# Altium schematic sheet EMG_v5.SchDoc
size 297 x 209 mm
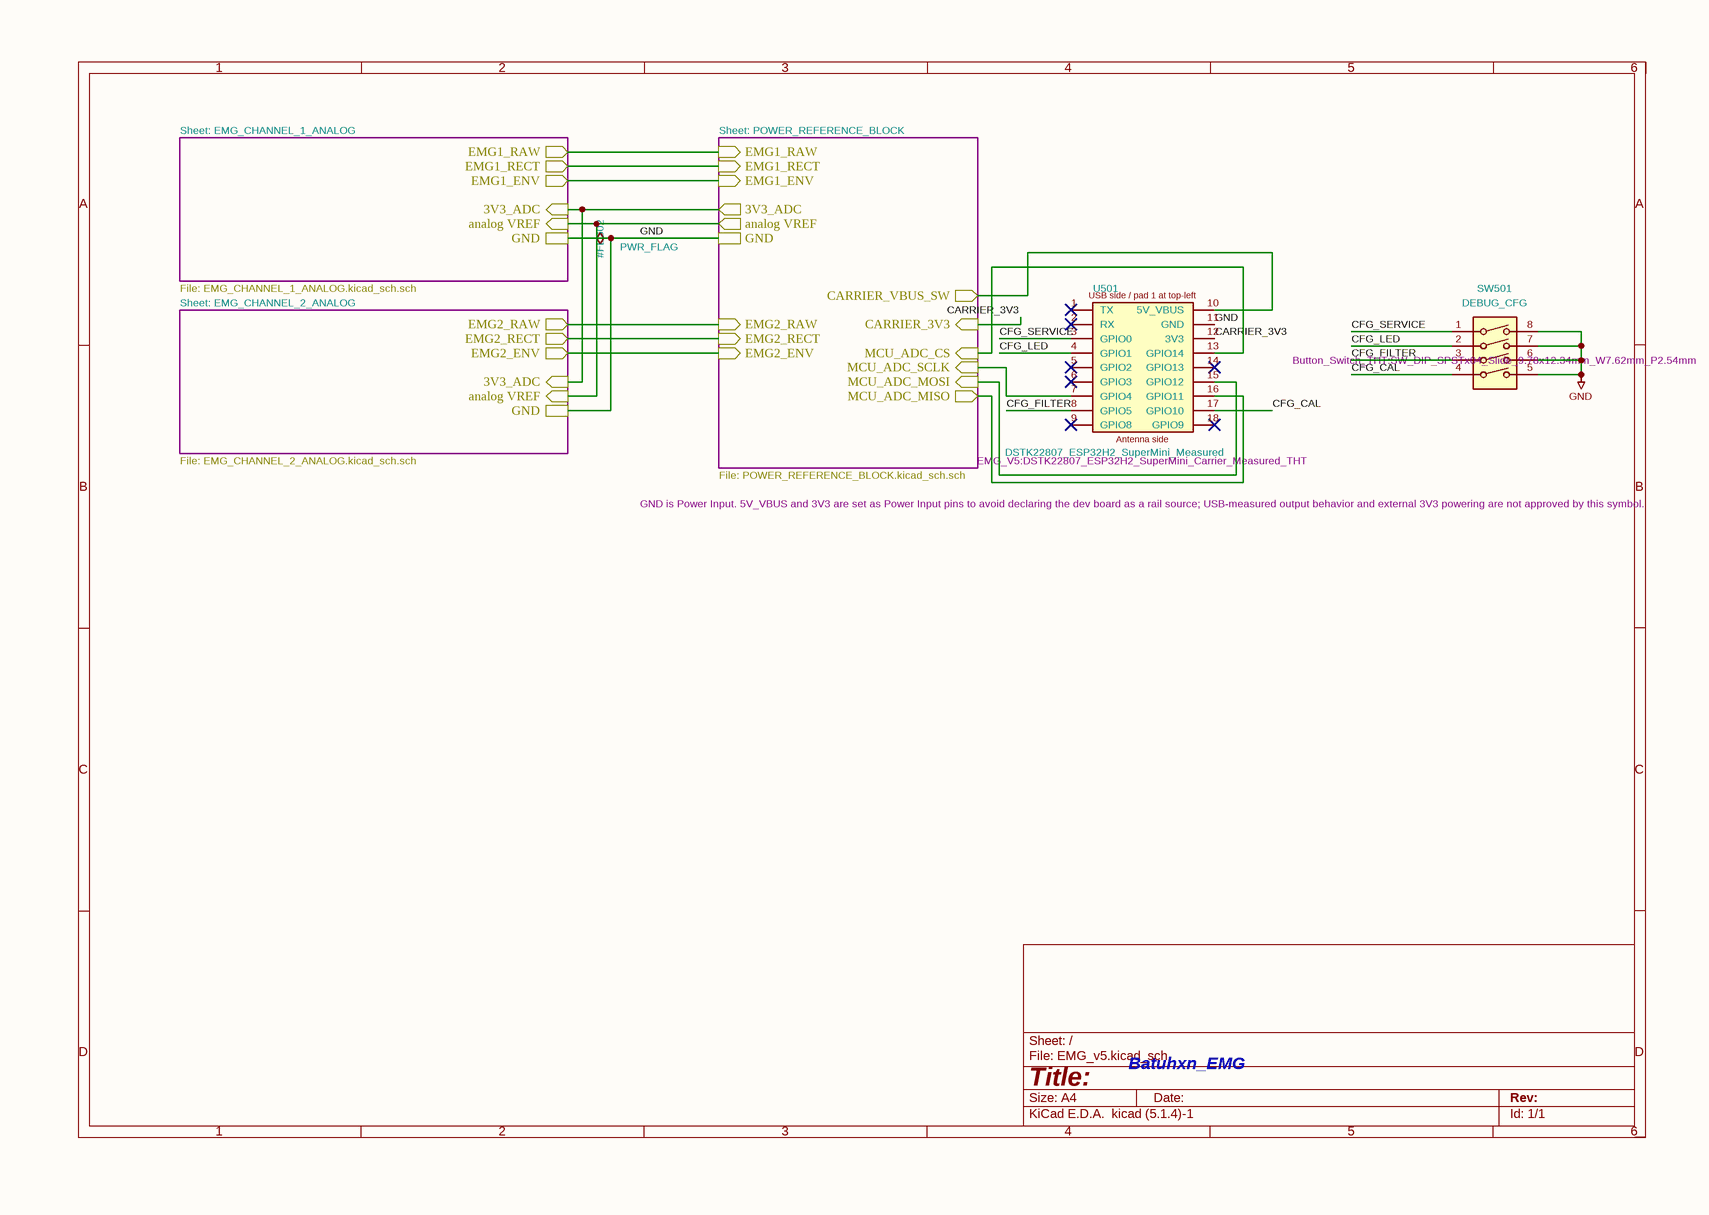
[diagram p0: EMG_v5.SchDoc]

## Parts
#FLG02  PWR_FLAG  (graphical)
SW501  Footprint: Button_Switch_THT:SW_DIP_SPSTx04_Slide_9.78x12.34mm_W7.62mm_P2.54mm  [SW_DIP_SPSTx04_Slide_9.78x12.34mm_W7.62mm_P2.54mm]  (hidden comment: DEBUG_CFG)
U501  Power_Assumption: GND is Power Input. 5V_VBUS and 3V3 are set as Power Input pins to avoid declaring the dev board as a rail source; USB-measured output behavior and external 3V3 powering are not approved by this symbol.  Footprint: EMG_V5:DSTK22807_ESP32H2_SuperMini_Carrier_Measured_THT  [DSTK22807_ESP32H2_SuperMini_Carrier_Measured_THT]  (hidden comment: DSTK22807_ESP32H2_SuperMini_Measured)

## Sub-sheets
EMG_CHANNEL_1_ANALOG = EMG_CHANNEL_1_ANALOG.SchDoc: EMG1_RAW (out), EMG1_RECT (out), EMG1_ENV (out), 3V3_ADC (in), analog VREF (in), GND
EMG_CHANNEL_2_ANALOG = EMG_CHANNEL_2_ANALOG.SchDoc: EMG2_RAW (out), EMG2_RECT (out), EMG2_ENV (out), 3V3_ADC (in), analog VREF (in), GND
POWER_REFERENCE_BLOCK = POWER_REFERENCE_BLOCK.SchDoc: EMG1_RAW (in), EMG1_RECT (in), EMG1_ENV (in), EMG2_RAW (in), EMG2_RECT (in), EMG2_ENV (in), 3V3_ADC (out), analog VREF (out), GND, CARRIER_VBUS_SW (out), CARRIER_3V3 (in), MCU_ADC_MISO (out), MCU_ADC_MOSI (in), MCU_ADC_SCLK (in), MCU_ADC_CS (in)

## Nets
GND: #FLG02.1 SW501.5 SW501.6 SW501.7 SW501.8 U501.11(GND) ; sheet POWER_REFERENCE_BLOCK/GND, sheet EMG_CHANNEL_1_ANALOG/GND, sheet EMG_CHANNEL_2_ANALOG/GND
CARRIER_3V3: U501.12(3V3) ; sheet POWER_REFERENCE_BLOCK/CARRIER_3V3
CFG_CAL: SW501.4 U501.17(GPIO10)
CFG_FILTER: SW501.3 U501.8(GPIO5)
CFG_LED: SW501.2 U501.4(GPIO1)
CFG_SERVICE: SW501.1 U501.3(GPIO0)
NetU501_7: U501.7(GPIO4) ; sheet POWER_REFERENCE_BLOCK/MCU_ADC_SCLK
NetU501_10: U501.10(5V_VBUS) ; sheet POWER_REFERENCE_BLOCK/CARRIER_VBUS_SW
NetU501_13: U501.13(GPIO14) ; sheet POWER_REFERENCE_BLOCK/MCU_ADC_CS
NetU501_15: U501.15(GPIO12) ; sheet POWER_REFERENCE_BLOCK/MCU_ADC_MOSI
NetU501_16: U501.16(GPIO11) ; sheet POWER_REFERENCE_BLOCK/MCU_ADC_MISO
(unnamed): sheet POWER_REFERENCE_BLOCK/EMG1_RAW, sheet EMG_CHANNEL_1_ANALOG/EMG1_RAW
(unnamed): sheet POWER_REFERENCE_BLOCK/EMG1_RECT, sheet EMG_CHANNEL_1_ANALOG/EMG1_RECT
(unnamed): sheet POWER_REFERENCE_BLOCK/EMG1_ENV, sheet EMG_CHANNEL_1_ANALOG/EMG1_ENV
(unnamed): sheet POWER_REFERENCE_BLOCK/EMG2_RAW, sheet EMG_CHANNEL_2_ANALOG/EMG2_RAW
(unnamed): sheet POWER_REFERENCE_BLOCK/EMG2_RECT, sheet EMG_CHANNEL_2_ANALOG/EMG2_RECT
(unnamed): sheet POWER_REFERENCE_BLOCK/EMG2_ENV, sheet EMG_CHANNEL_2_ANALOG/EMG2_ENV
(unnamed): sheet POWER_REFERENCE_BLOCK/3V3_ADC, sheet EMG_CHANNEL_1_ANALOG/3V3_ADC, sheet EMG_CHANNEL_2_ANALOG/3V3_ADC
(unnamed): sheet POWER_REFERENCE_BLOCK/analog VREF, sheet EMG_CHANNEL_1_ANALOG/analog VREF, sheet EMG_CHANNEL_2_ANALOG/analog VREF

Not connected (* = marked no-connect by the designer): U501 1(TX)* 2(RX)* 5(GPIO2)* 6(GPIO3)* 9(GPIO8)* 14(GPIO13)* 18(GPIO9)*

## Notes on the sheet
- Sheet: EMG_CHANNEL_1_ANALOG
- Sheet: POWER_REFERENCE_BLOCK
- File: EMG_CHANNEL_1_ANALOG.kicad_sch.sch
- Sheet: EMG_CHANNEL_2_ANALOG
- File: EMG_CHANNEL_2_ANALOG.kicad_sch.sch
- File: POWER_REFERENCE_BLOCK.kicad_sch.sch
- Batuhxn_EMG
- 1
- 2
- 3
- 4
- 5
- 6
- A
- B
- C
- D
- Title:
- File: EMG_v5.kicad_sch
- Sheet: /
- KiCad E.D.A.  kicad (5.1.4)-1
- Size: A4
- Date:
- Rev:
- Id: 1/1
- (in symbol DSTK22807_ESP32H2_SuperMini_Measured) USB side / pad 1 at top-left; Antenna side

## Library data of the parts
SW501 = SW_DIP_x04: Value: DEBUG_CFG
#FLG02 = PWR_FLAG: Value: PWR_FLAG
U501 = DSTK22807_ESP32H2_SuperMini_Measured: Value: DSTK22807_ESP32H2_SuperMini_Measured